# EAGLE schematic ENC28J60 Wing (EAGLE 6.4)
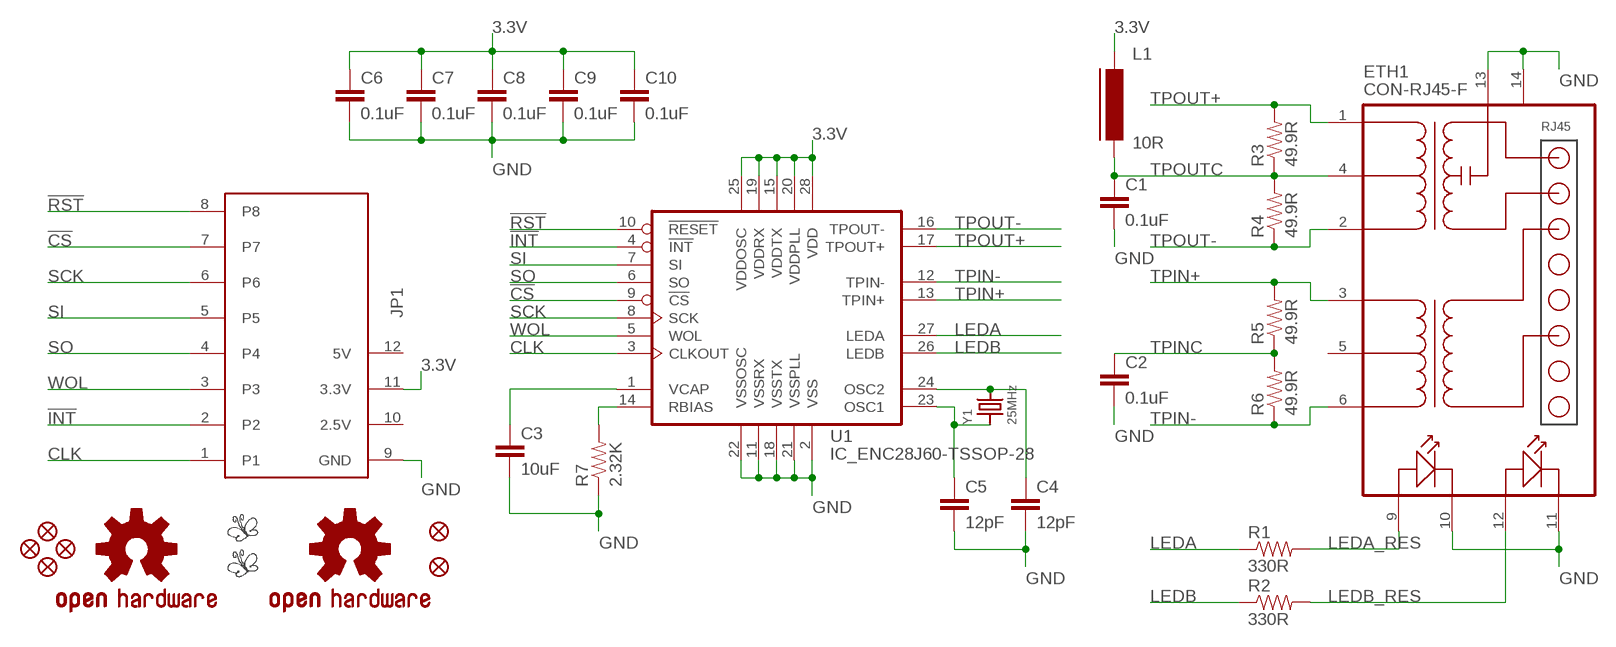
[diagram p0: schematic, sheet 1]

## Parts
C1  0.1uF  CAP0402-CAP  [0402-CAP]
C2  0.1uF  CAP0402-CAP  [0402-CAP]
C3  10uF  CAP1206  [1206]
C4  12pF  CAP0402-CAP  [0402-CAP]
C5  12pF  CAP0402-CAP  [0402-CAP]
C6  0.1uF  CAP0402-CAP  [0402-CAP]
C7  0.1uF  CAP0402-CAP  [0402-CAP]
C8  0.1uF  CAP0402-CAP  [0402-CAP]
C9  0.1uF  CAP0402-CAP  [0402-CAP]
C10  0.1uF  CAP0402-CAP  [0402-CAP]
ETH1  CON-RJ45-F  [HR911105A]
FID1  FIDUCIALUFIDUCIAL  [MICRO-FIDUCIAL]
FID2  FIDUCIALUFIDUCIAL  [MICRO-FIDUCIAL]
FID3  FIDUCIALUFIDUCIAL  [MICRO-FIDUCIAL]
FID4  FIDUCIALUFIDUCIAL  [MICRO-FIDUCIAL]
FID5  FIDUCIALUFIDUCIAL  [MICRO-FIDUCIAL]
FID6  FIDUCIALUFIDUCIAL  [MICRO-FIDUCIAL]
JP1  PAPILIO-WING-8BITS  [PAPILIO-WING-8BITS]
L1  10R  FERRITE-0402  [FB402]
LOGO1  BUTTERFLY_LOGO  [BUTTERFLY_LOGO]
LOGO2  BUTTERFLY_LOGO  [BUTTERFLY_LOGO]
R1  330R  RESISTOR0402-RES  [0402-RES]
R2  330R  RESISTOR0402-RES  [0402-RES]
R3  49.9R  RESISTOR0402-RES  [0402-RES]
R4  49.9R  RESISTOR0402-RES  [0402-RES]
R5  49.9R  RESISTOR0402-RES  [0402-RES]
R6  49.9R  RESISTOR0402-RES  [0402-RES]
R7  2.32K  RESISTOR0402-RES  [0402-RES]
U1  IC_ENC28J60-TSSOP-28  [TSSOP-28]
U$2  OSHW-LOGOS  [OSHW-LOGO-S]
U$3  OSHW-LOGOS  [OSHW-LOGO-S]
Y1  25MHz  CRYSTAL2.5X2.0MM  [CRYSTAL_2.5X2]

## Nets
3.3V: C6.1 C7.1 C8.1 C9.1 C10.1 JP1.11(3.3V) L1.1 U1.15(VDDTX) U1.19(VDDRX) U1.20(VDDPLL) U1.25(VDDOSC) U1.28(VDD)
!CS!: JP1.7 U1.9(!CS)
!INT!: JP1.2 U1.4(!INT)
!RST!: JP1.8 U1.10(!RESET)
CLK: JP1.1 U1.3(CLKOUT)
GND: C1.2 C2.2 C3.2 C4.2 C5.2 C6.2 C7.2 C8.2 C9.2 C10.2 ETH1.10 ETH1.11 ETH1.13 ETH1.14 JP1.9(GND) R7.1 U1.2(VSS) U1.11(VSSRX) U1.18(VSSTX) U1.21(VSSPLL) U1.22(VSSOSC)
LEDA: R1.1 U1.27(LEDA)
LEDA_RES: ETH1.9 R1.2
LEDB: R2.1 U1.26(LEDB)
LEDB_RES: ETH1.12 R2.2
OSC1: C5.1 U1.23(OSC1) Y1.1
OSC2: C4.1 U1.24(OSC2) Y1.3
RBIAS: R7.2 U1.14(RBIAS)
SCK: JP1.6 U1.8(SCK)
SI: JP1.5 U1.7(SI)
SO: JP1.4 U1.6(SO)
TPIN+: ETH1.3 R5.2 U1.13(TPIN+)
TPIN-: ETH1.6 R6.1 U1.12(TPIN-)
TPINC: C2.1 R5.1 R6.2
TPOUT+: ETH1.1 R3.2 U1.17(TPOUT+)
TPOUT-: ETH1.2 R4.1 U1.16(TPOUT-)
TPOUTC: C1.1 ETH1.4 L1.2 R3.1 R4.2
VCAP: C3.1 U1.1(VCAP)
WOL: JP1.3 U1.5(WOL)
Unconnected: ETH1.5 JP1.10(2.5V) JP1.12(5V)

## Library data of the parts
C1-C10 = SparkFun-Capacitors:CAP: Capacitor Standard 0603 ceramic capacitor, and 0.1" leaded capacitor.
ETH1 = dp_devices:CON-RJ45-F: HR911105A Female Ethernet RJ-45 with internal transformer and 2 LEDs
FID1-FID6 = SparkFun-Aesthetics:FIDUCIAL: Fiducial Alignment Points Various fiducial points for machine vision alignment.
JP1 = logxen:PAPILIO-WING-8BITS
L1 = dp_devices:FERRITE: Ferrite bead in various packages
LOGO1 LOGO2 = GadgetFactory_Pub:BUTTERFLY_LOGO
R1-R7 = SparkFun-Resistors:RESISTOR: Resistor Basic schematic elements and footprints for 0603, 1206, and PTH resistors.
U1 = logxen:IC_ENC28J60: Ethernet Controller with SPI Interface
U$2 U$3 = SparkFun-Aesthetics:OSHW-LOGO: Open Source Hardware Logo This logo indicates the piece of hardware it is found on incorporates a OSHW license and/or adheres to the definition of open source hardware found here: http://freedomdefined.org/OSHW
Y1 = microbuilder:CRYSTAL: Crystals HC49UP - Surface Mount Crystal 4.0MHz 18pF +/-30ppm Surface Mount Crystal [Digikey: 535-9857-1-ND] 12.0 MHz Surface Mount Crystal [Digikey: 535-9869-6-ND] 25.0 MHz Surface Mount Crystal [Digikey: 535-9078-1-ND] 2.5 x 2.0mm - MEMs SMT Crystal 16.0 MHz 10pF 20ppm 2.5 x 2.0mm Crystal [Digikey -40-85°C: 535-10923-1-ND] 3.2 x 2.5mm - MEMs SMT Crystal 12.0 MHz 8pF 15ppm 3.2 x 2.5mm Crystal [Digikey: -10-70°C: 644-1047-1-ND -40-125°C: 644-1128-1-ND] 16.0 MHz 8pF 15ppm 3.2 x 2.5mm Crystal [Digikey: -10-70°C: 644-1049-1-ND -40-125°C: 644-1129-2-ND] 16.0 MHz 10pF 10ppm 3.2 x 2.5mm Crystal [Digikey: 644-1100-1-ND] 27.12 MHz 18pF 30ppm 3.2 x 2.5mm Crystal [Digikey: 887-1424-1-ND] 27.12MHz 10pF 10ppm 3.2 x 2.5mm Crystal [Digikey: 887-1329-1-ND] 4.9 x 1.8mm - MEMs SMT Crystal 32.768 KHz 12.5pF 20ppm 4.9 x 1.8mm Crystal [Digikey: SE2415CT-ND] 8.0 x 3.8mm - Surface Mount Crystal 32.768kHz 12.5pF 20ppm -40°C-85°C [Digikey: 535-9166-2-ND] Cylinder 32.768KHz Cylinder Crystal (2x6mm body) [Ex. Digikey: 300-8341-2-ND]